# Altium schematic sheet interface.SchDoc
size A4; SheetNumber: 3; SheetTotal: 4
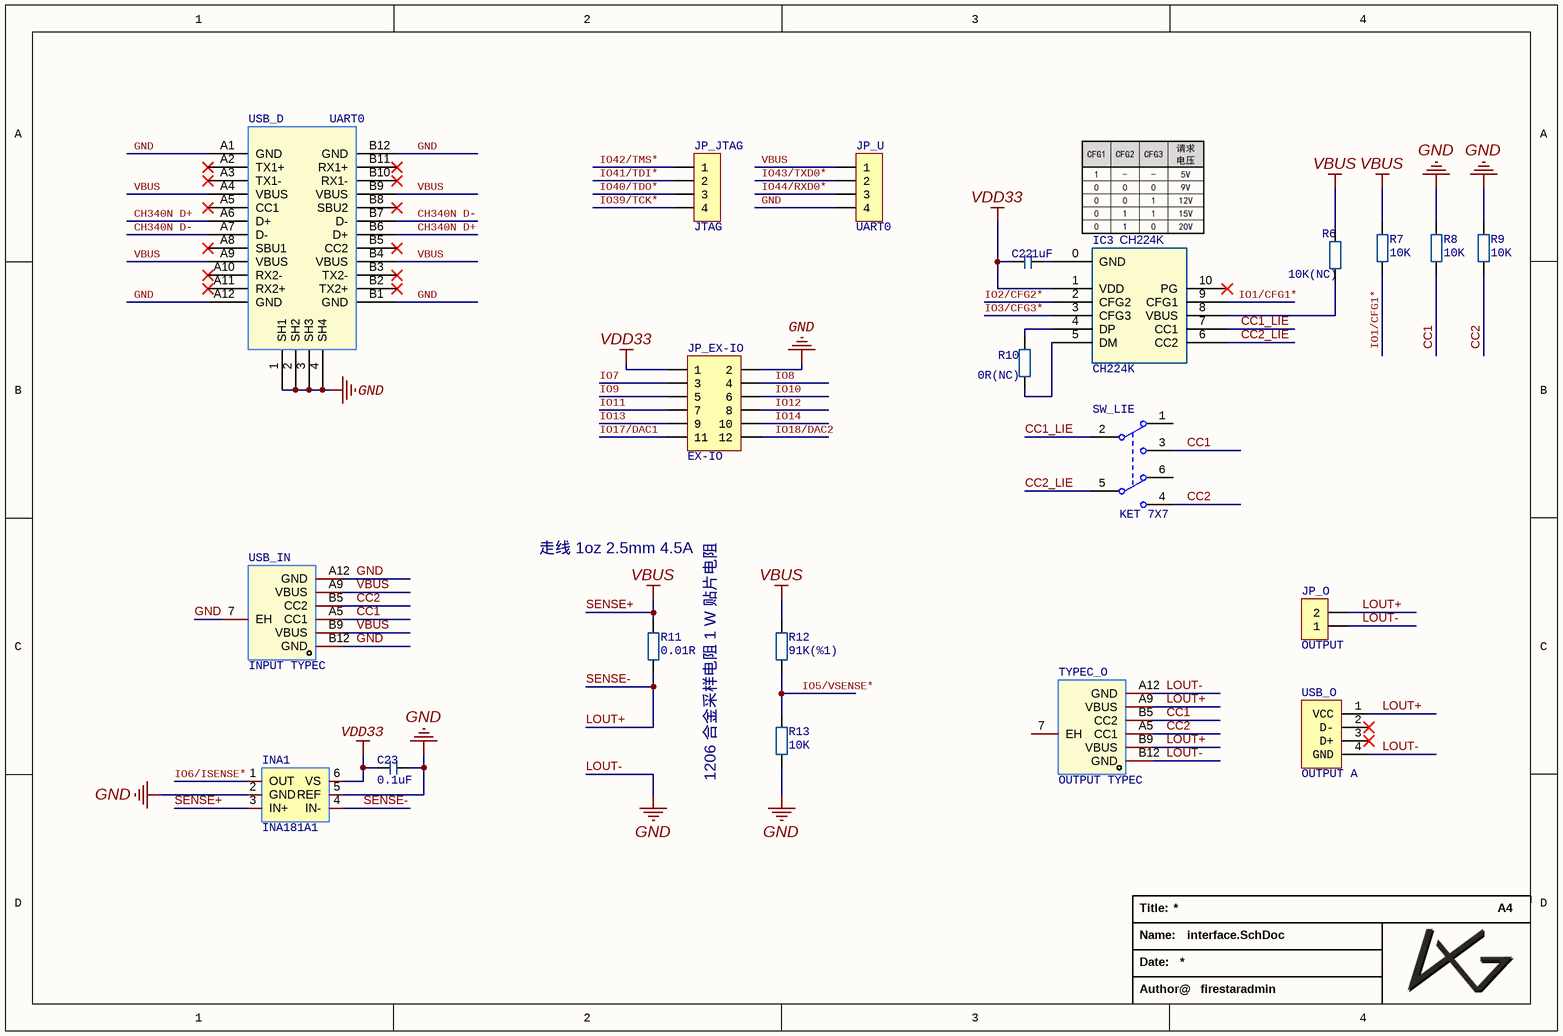
[diagram p0: interface.SchDoc]

## Parts
C22  1uF  [C 0603_L]
C23  0.1uF  [C 0603_L]
IC3  CH224K  [ESSOP10-1mm]
INA1  INA181A1  [SOT23-6L]
JP_EX-IO  EX-IO  [HDR2.54-LI-2x6P]
JP_JTAG  JTAG  [HDR2.54-LI-4P]
JP_O  OUTPUT  [KF301-5.0-2P]
JP_U  UART0  [HDR2.54-LI-4P]
R6  10K(NC)  [R 0603_L]
R7  10K  [R 0603_L]
R8  10K  [R 0603_L]
R9  10K  [R 0603_L]
R10  0R(NC)  [R 0603_L]
R11  0.01R  [R 1206_L]
R12  91K(%1)  [R 0603_L]
R13  10K  [R 0603_L]
SW_LIE  KET 7X7  [KFT DIP-7X7]
TYPEC_O  OUTPUT TYPEC  [TYPE-C-6P]
USB_D  UART0  [TYPE-C-16P]
USB_IN  INPUT TYPEC  [TYPE-C-6P]
USB_O  OUTPUT A  [USB-A/S_B]

## Nets
GND: C23.1 INA1.2(GND) INA1.5(REF) JP_EX-IO.2 JP_O.1 JP_U.4 R8.1 R9.1 R13.1 TYPEC_O.A12(GND) TYPEC_O.B12(GND) USB_D.1(SH1) USB_D.2(SH2) USB_D.3(SH3) USB_D.4(SH4) USB_D.A1(GND) USB_D.A12(GND) USB_D.B1(GND) USB_D.B12(GND) USB_IN.7(EH) USB_IN.A12(GND) USB_IN.B12(GND) USB_O.4(GND)  [also labelled LOUT-]
SENSE+: INA1.3(IN+) JP_U.1 R6.1 R7.1 R11.2 R12.2 USB_D.A4(VBUS) USB_D.A9(VBUS) USB_D.B4(VBUS) USB_D.B9(VBUS) USB_IN.A9(VBUS) USB_IN.B9(VBUS)  [also labelled VBUS]
VDD33: C22.2 C23.2 IC3.1(VDD) INA1.6(VS) JP_EX-IO.1
CC1: R8.2 SW_LIE.3(NO1) TYPEC_O.B5(CC2) USB_IN.A5(CC1)
CC1_LIE: IC3.7(CC1) SW_LIE.2(COM2)
CC2: R9.2 SW_LIE.4(NO2) TYPEC_O.A5(CC1) USB_IN.B5(CC2)
CC2_LIE: IC3.6(CC2) SW_LIE.5(COM2)
CH340N D+: USB_D.A6(D+) USB_D.B6(D+)
CH340N D-: USB_D.A7(D-) USB_D.B7(D-)
IO1/CFG1*: IC3.9(CFG1) R7.2
IO2/CFG2*: IC3.2(CFG2)
IO3/CFG3*: IC3.3(CFG3)
IO5/VSENSE*: R12.1 R13.2
IO6/ISENSE*: INA1.1(OUT)
IO7: JP_EX-IO.3
IO8: JP_EX-IO.4
IO9: JP_EX-IO.5
IO10: JP_EX-IO.6
IO11: JP_EX-IO.7
IO12: JP_EX-IO.8
IO13: JP_EX-IO.9
IO14: JP_EX-IO.10
IO17/DAC1: JP_EX-IO.11
IO18/DAC2: JP_EX-IO.12
IO39/TCK*: JP_JTAG.4
IO40/TDO*: JP_JTAG.3
IO41/TDI*: JP_JTAG.2
IO42/TMS*: JP_JTAG.1
IO43/TXD0*: JP_U.2
IO44/RXD0*: JP_U.3
LOUT+: INA1.4(IN-) JP_O.2 R11.1 TYPEC_O.A9(VBUS) TYPEC_O.B9(VBUS) USB_O.1(VCC)  [also labelled SENSE-]
NetC22_1: C22.1 IC3.0(GND)
NetIC3_4: IC3.4(DP) R10.1
NetIC3_5: IC3.5(DM) R10.2
NetIC3_8: IC3.8(VBUS) R6.2

Not connected (* = marked no-connect by the designer): IC3 10(PG)*; SW_LIE 1(NC1) 6(NC2); TYPEC_O 7(EH); USB_D A2(TX1+)* A3(TX1-)* A5(CC1)* A8(SBU1)* A10(RX2-)* A11(RX2+)* B2(TX2+)* B3(TX2-)* B5(CC2)* B8(SBU2)* B10(RX1-)* B11(RX1+)*; USB_O 2(D-)* 3(D+)*

## Notes on the sheet
- 走线 1oz 2.5mm 4.5A
- 1206 合金采样电阻 1 W 贴片电阻
- Title:
- A4
- Name:
- Date:
- Author@
- firestaradmin

## Library data of the parts
C22 C23 = C: 无极性贴片电容; 版权归属: 源创客; BOM名称: 无极性贴片电容; 学习资源: www.ooocke.com
IC3 = CH224K: 支持 4V 至 22V 输入电压 / l 支持 PD3.0/2.0，BC1.2 等快充协议 / l 支持 USB Type-C PD，支持正反插检测与自动切换 / l 支持 E-Mark 模拟，自动检测 VCONN，支持 100W 功率
INA1 = INA181A1: 电流检测
JP_EX-IO = Header  6X2: 6*2P接插件; 版权归属: 源创客; BOM名称: 6*2P接插件; 学习资源: www.ooocke.com
JP_JTAG JP_U = Header 4: 4P接插件; 版权归属: 源创客; BOM名称: 4P接插件; 学习资源: www.ooocke.com
JP_O = Header 2: 2P接插件; 版权归属: 源创客; BOM名称: 2P接插件; 学习资源: www.ooocke.com
R6-R10 R12 R13 = R: 贴片电阻; 版权归属: 源创客; BOM名称: 贴片电阻; 学习资源: www.ooocke.com
R11 = R: 1206 合金采样电阻 1 W 贴片电阻; 版权归属: 源创客; BOM名称: 贴片电阻; 学习资源: www.ooocke.com
SW_LIE = KET 7X7: 7*7自锁开关; 版权归属: 源创客; BOM名称: 7*7自锁开关; 学习资源: www.ooocke.com
TYPEC_O USB_IN = TYPE-C 6P: Manufacturer: SHOU HAN(首韩); Add into BOM: yes; Connector Type: Type-C; Gender: 母座; Number of Contacts: 6; Number of Ports: 1; Symbol: TYPE-C 6P; Device: TYPE-C 6P; LCSC Part Name: Type-C 母头 6pin简易款四脚端子SMT+DIP 停产; Supplier Part: C456012; Manufacturer Part: TYPE-C 6P; Supplier Footprint: SMD; JLCPCB Part Class: Extended Part; Datasheet: https://atta.szlcsc.com/upload/public/pdf/source/20201203/C456012_B13F72044DF846EDBE9BDD0D1D3CD166.pdf; Supplier: LCSC; Convert to PCB: yes; Standard: -; Mounting Style: 卧贴; Current Rating - Power (Max): -; Operating Temperature Range: -40~+85
USB_D = TypeC-16P: Type-C 16Pin
USB_O = USB-A/S: USB-A型母接口; 版权归属: 源创客; BOM名称: USB-A型母接口; 学习资源: www.ooocke.com